# Altium project OVLYS.PrjPcb
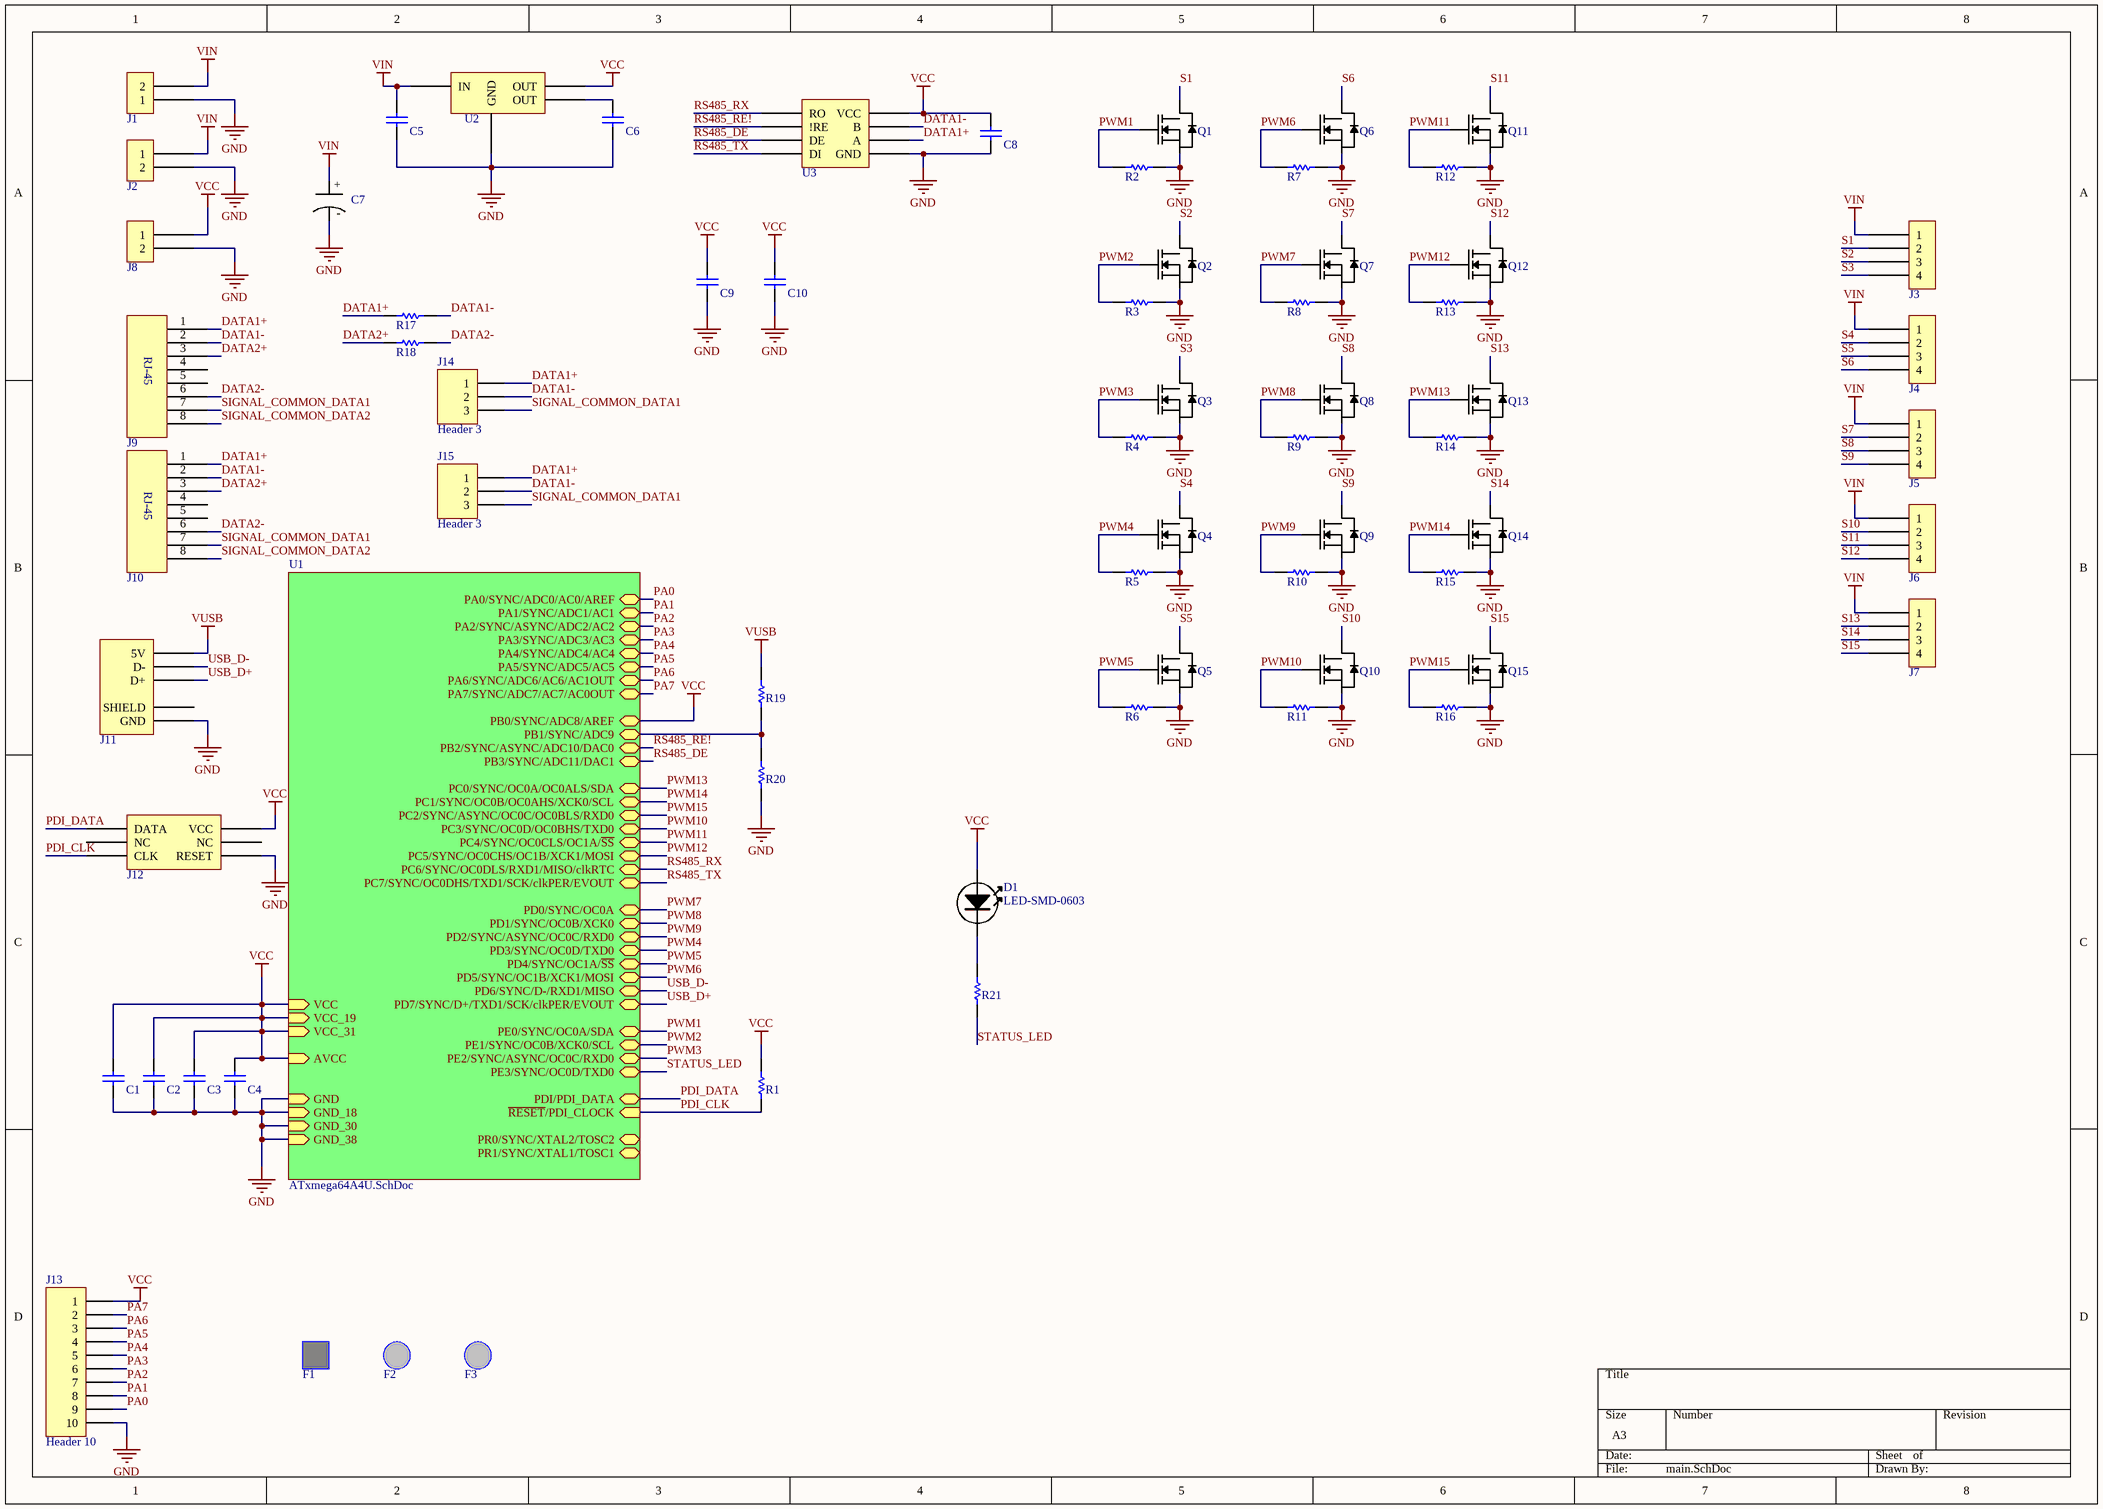
[diagram p0: main.SchDoc]
2 sheets, 69 parts. Net scope: hierarchical (ports join the sheet entries above them; power ports are global).
Board files: main.PcbDoc, panelized.PcbDoc
Sheets:
  main.SchDoc
    U1 = ATxmega64A4U.SchDoc

## Sheet main.SchDoc
size A3

### Parts
C1  CAP 3.3nF 10V 0805(2012)  [CAPC0805(2012)145_M]  (value not drawn)
C2  CAP 3.3nF 10V 0805(2012)  [CAPC0805(2012)145_M]  (value not drawn)
C3  CAP 3.3nF 10V 0805(2012)  [CAPC0805(2012)145_M]  (value not drawn)
C4  CAP 3.3nF 10V 0805(2012)  [CAPC0805(2012)145_M]  (value not drawn)
C5  CAP 1uF 16V 1210(3225)  [CAPC1210(3225)155_N]  (value not drawn)
C6  CAP 10uF 6.3V 1210(3225)  [CAPC1210(3225)170_L]  (value not drawn)
C7  ELECTROLYTIC-CAP-220uF  [ELECTROLYTIC-220uF]  (value not drawn)
C8  CAP 3.3nF 10V 0805(2012)  [CAPC0805(2012)145_M]  (value not drawn)
C9  CAP 10uF 6.3V 1210(3225)  [CAPC1210(3225)170_L]  (value not drawn)
C10  CAP 10uF 6.3V 1210(3225)  [CAPC1210(3225)170_L]  (value not drawn)
D1  LED-SMD-0603  [LED-0603]
F1  Fiducial square  [FIDU-SQUARE]  (value not drawn)
F2  Fiducial round  [FIDU-ROUND]  (value not drawn)
F3  Fiducial round  [FIDU-ROUND]  (value not drawn)
J1  PLUGGABLE-TERMINAL-2  [PLUG_TERMINAL_2]  (value not drawn)
J2  PLUGGABLE-TERMINAL-2  [PLUG_TERMINAL_2]  (value not drawn)
J3  PLUGGABLE-TERMINAL-4  [PLUG_TERMINAL_4]  (value not drawn)
J4  PLUGGABLE-TERMINAL-4  [PLUG_TERMINAL_4]  (value not drawn)
J5  PLUGGABLE-TERMINAL-4  [PLUG_TERMINAL_4]  (value not drawn)
J6  PLUGGABLE-TERMINAL-4  [PLUG_TERMINAL_4]  (value not drawn)
J7  PLUGGABLE-TERMINAL-4  [PLUG_TERMINAL_4]  (value not drawn)
J8  PLUGGABLE-TERMINAL-2  [PLUG_TERMINAL_2]  (value not drawn)
J9  RJ-45 Connector  [RJ-45]  (value not drawn)
J10  RJ-45 Connector  [RJ-45]  (value not drawn)
J11  USB-MINI  [USB-mini]  (value not drawn)
J12  PDI  [HEADER_SMD_3x2_50MIL]  (value not drawn)
J13  Header 10  [HDR1X10]
J14  Header 3  [HDR1X3]
J15  Header 3  [HDR1X3]
Q1  TSM2314CX  [SOT95P280X130-3N]  (value not drawn)
Q2  TSM2314CX  [SOT95P280X130-3N]  (value not drawn)
Q3  TSM2314CX  [SOT95P280X130-3N]  (value not drawn)
Q4  TSM2314CX  [SOT95P280X130-3N]  (value not drawn)
Q5  TSM2314CX  [SOT95P280X130-3N]  (value not drawn)
Q6  TSM2314CX  [SOT95P280X130-3N]  (value not drawn)
Q7  TSM2314CX  [SOT95P280X130-3N]  (value not drawn)
Q8  TSM2314CX  [SOT95P280X130-3N]  (value not drawn)
Q9  TSM2314CX  [SOT95P280X130-3N]  (value not drawn)
Q10  TSM2314CX  [SOT95P280X130-3N]  (value not drawn)
Q11  TSM2314CX  [SOT95P280X130-3N]  (value not drawn)
Q12  TSM2314CX  [SOT95P280X130-3N]  (value not drawn)
Q13  TSM2314CX  [SOT95P280X130-3N]  (value not drawn)
Q14  TSM2314CX  [SOT95P280X130-3N]  (value not drawn)
Q15  TSM2314CX  [SOT95P280X130-3N]  (value not drawn)
R1  10K 1% 0805(2012)  [RESC0805(2012)_M]  (value not drawn)
R2  10K 1% 0805(2012)  [RESC0805(2012)_M]  (value not drawn)
R3  10K 1% 0805(2012)  [RESC0805(2012)_M]  (value not drawn)
R4  10K 1% 0805(2012)  [RESC0805(2012)_M]  (value not drawn)
R5  10K 1% 0805(2012)  [RESC0805(2012)_M]  (value not drawn)
R6  10K 1% 0805(2012)  [RESC0805(2012)_M]  (value not drawn)
R7  10K 1% 0805(2012)  [RESC0805(2012)_M]  (value not drawn)
R8  10K 1% 0805(2012)  [RESC0805(2012)_M]  (value not drawn)
R9  10K 1% 0805(2012)  [RESC0805(2012)_M]  (value not drawn)
R10  10K 1% 0805(2012)  [RESC0805(2012)_M]  (value not drawn)
R11  10K 1% 0805(2012)  [RESC0805(2012)_M]  (value not drawn)
R12  10K 1% 0805(2012)  [RESC0805(2012)_M]  (value not drawn)
R13  10K 1% 0805(2012)  [RESC0805(2012)_M]  (value not drawn)
R14  10K 1% 0805(2012)  [RESC0805(2012)_M]  (value not drawn)
R15  10K 1% 0805(2012)  [RESC0805(2012)_M]  (value not drawn)
R16  10K 1% 0805(2012)  [RESC0805(2012)_M]  (value not drawn)
R17  120R 1% 0805(2012)  [RESC0805(2012)_M]  (value not drawn)
R18  120R 1% 0805(2012)  [RESC0805(2012)_M]  (value not drawn)
R19  10K 1% 0805(2012)  [RESC0805(2012)_M]  (value not drawn)
R20  15K 1% 0805(2012)  [RESC0805(2012)_L]  (value not drawn)
R21  200R 1% 0805(2012)  [RESC0805(2012)_L]  (value not drawn)
U2  TLV1117  [SOT230P700X180-4N]  (value not drawn)
U3  MAX3485  [SOP127P600X175-8N]  (value not drawn)

### Sub-sheets
U1 = ATxmega64A4U.SchDoc: PR0/SYNC/XTAL2/TOSC2 (bidir), PR1/SYNC/XTAL1/TOSC1 (bidir), ~{RESET}/PDI_CLOCK (in), VCC, VCC_19, AVCC, GND, GND_18, GND_30, PA0/SYNC/ADC0/AC0/AREF (bidir), PA1/SYNC/ADC1/AC1 (bidir), PA2/SYNC/ASYNC/ADC2/AC2 (bidir), PA3/SYNC/ADC3/AC3 (bidir), PA4/SYNC/ADC4/AC4 (bidir), PA5/SYNC/ADC5/AC5 (bidir), PA6/SYNC/ADC6/AC6/AC1OUT (bidir), PA7/SYNC/ADC7/AC7/AC0OUT (bidir), PB0/SYNC/ADC8/AREF (bidir), PB1/SYNC/ADC9 (bidir), PB3/SYNC/ADC11/DAC1 (bidir), PC0/SYNC/OC0A/OC0ALS/SDA (bidir), PC1/SYNC/OC0B/OC0AHS/XCK0/SCL (bidir), PC2/SYNC/ASYNC/OC0C/OC0BLS/RXD0 (bidir), PC3/SYNC/OC0D/OC0BHS/TXD0 (bidir), PC4/SYNC/OC0CLS/OC1A/~{SS} (bidir), PC5/SYNC/OC0CHS/OC1B/XCK1/MOSI (bidir), PC6/SYNC/OC0DLS/RXD1/MISO/clkRTC (bidir), PC7/SYNC/OC0DHS/TXD1/SCK/clkPER/EVOUT (bidir), PD0/SYNC/OC0A (bidir), PD2/SYNC/ASYNC/OC0C/RXD0 (bidir), PD3/SYNC/OC0D/TXD0 (bidir), PD4/SYNC/OC1A/~{SS} (bidir), PD5/SYNC/OC1B/XCK1/MOSI (bidir), PD6/SYNC/D-/RXD1/MISO (bidir), PD7/SYNC/D+/TXD1/SCK/clkPER/EVOUT (bidir), PDI/PDI_DATA (bidir), PE0/SYNC/OC0A/SDA (bidir), PE1/SYNC/OC0B/XCK0/SCL (bidir), PE2/SYNC/ASYNC/OC0C/RXD0 (bidir), GND_38, PB2/SYNC/ASYNC/ADC10/DAC0 (bidir), PD1/SYNC/OC0B/XCK0 (bidir), PE3/SYNC/OC0D/TXD0 (bidir), VCC_31

### Nets
GND: C1.1 C2.1 C3.1 C4.1 C5.1 C6.1 C7.2(-) C8.1 C9.1 C10.1 J1.1 J2.2 J8.2 J11.5(GND) J12.6(RESET) J13.10 Q1.2(S) Q2.2(S) Q3.2(S) Q4.2(S) Q5.2(S) Q6.2(S) Q7.2(S) Q8.2(S) Q9.2(S) Q10.2(S) Q11.2(S) Q12.2(S) Q13.2(S) Q14.2(S) Q15.2(S) R2.2 R3.2 R4.2 R5.2 R6.2 R7.2 R8.2 R9.2 R10.2 R11.2 R12.2 R13.2 R14.2 R15.2 R16.2 R20.1 U2.1(GND) U3.5(GND) ; sheet U1/GND, sheet U1/GND_18, sheet U1/GND_30, sheet U1/GND_38
VCC: C1.2 C2.2 C3.2 C4.2 C8.2 C9.2 C10.2 D1.1 J8.1 J12.2(VCC) J13.1 R1.2 U2.4(OUT) U3.8(VCC) ; sheet U1/VCC, sheet U1/VCC_19, sheet U1/AVCC, sheet U1/PB0/SYNC/ADC8/AREF, sheet U1/VCC_31
VIN: C5.2 C7.1(+) J1.2 J2.1 J3.1 J4.1 J5.1 J6.1 J7.1 U2.3(IN)
VUSB: J11.1(5V) R19.2
DATA1+: J9.1 J10.1 J14.1 J15.1 R17.1 U3.6(A)
DATA1-: J9.2 J10.2 J14.2 J15.2 R17.2 U3.7(B)
DATA2+: J9.3 J10.3 R18.1
DATA2-: J9.6 J10.6 R18.2
PA0: J13.9 ; sheet U1/PA0/SYNC/ADC0/AC0/AREF
PA1: J13.8 ; sheet U1/PA1/SYNC/ADC1/AC1
PA2: J13.7 ; sheet U1/PA2/SYNC/ASYNC/ADC2/AC2
PA3: J13.6 ; sheet U1/PA3/SYNC/ADC3/AC3
PA4: J13.5 ; sheet U1/PA4/SYNC/ADC4/AC4
PA5: J13.4 ; sheet U1/PA5/SYNC/ADC5/AC5
PA6: J13.3 ; sheet U1/PA6/SYNC/ADC6/AC6/AC1OUT
PA7: J13.2 ; sheet U1/PA7/SYNC/ADC7/AC7/AC0OUT
PDI_CLK: J12.5(CLK) R1.1 ; sheet U1/~{RESET}/PDI_CLOCK
PDI_DATA: J12.1(DATA) ; sheet U1/PDI/PDI_DATA
PWM1: Q1.1(G) R2.1 ; sheet U1/PE0/SYNC/OC0A/SDA
PWM2: Q2.1(G) R3.1 ; sheet U1/PE1/SYNC/OC0B/XCK0/SCL
PWM3: Q3.1(G) R4.1 ; sheet U1/PE2/SYNC/ASYNC/OC0C/RXD0
PWM4: Q4.1(G) R5.1 ; sheet U1/PD3/SYNC/OC0D/TXD0
PWM5: Q5.1(G) R6.1 ; sheet U1/PD4/SYNC/OC1A/~{SS}
PWM6: Q6.1(G) R7.1 ; sheet U1/PD5/SYNC/OC1B/XCK1/MOSI
PWM7: Q7.1(G) R8.1 ; sheet U1/PD0/SYNC/OC0A
PWM8: Q8.1(G) R9.1 ; sheet U1/PD1/SYNC/OC0B/XCK0
PWM9: Q9.1(G) R10.1 ; sheet U1/PD2/SYNC/ASYNC/OC0C/RXD0
PWM10: Q10.1(G) R11.1 ; sheet U1/PC3/SYNC/OC0D/OC0BHS/TXD0
PWM11: Q11.1(G) R12.1 ; sheet U1/PC4/SYNC/OC0CLS/OC1A/~{SS}
PWM12: Q12.1(G) R13.1 ; sheet U1/PC5/SYNC/OC0CHS/OC1B/XCK1/MOSI
PWM13: Q13.1(G) R14.1 ; sheet U1/PC0/SYNC/OC0A/OC0ALS/SDA
PWM14: Q14.1(G) R15.1 ; sheet U1/PC1/SYNC/OC0B/OC0AHS/XCK0/SCL
PWM15: Q15.1(G) R16.1 ; sheet U1/PC2/SYNC/ASYNC/OC0C/OC0BLS/RXD0
RS485_DE: U3.3(DE) ; sheet U1/PB3/SYNC/ADC11/DAC1
RS485_RE!: U3.2(!RE) ; sheet U1/PB2/SYNC/ASYNC/ADC10/DAC0
RS485_RX: U3.1(RO) ; sheet U1/PC6/SYNC/OC0DLS/RXD1/MISO/clkRTC
RS485_TX: U3.4(DI) ; sheet U1/PC7/SYNC/OC0DHS/TXD1/SCK/clkPER/EVOUT
S1: J3.2 Q1.3(D)
S2: J3.3 Q2.3(D)
S3: J3.4 Q3.3(D)
S4: J4.2 Q4.3(D)
S5: J4.3 Q5.3(D)
S6: J4.4 Q6.3(D)
S7: J5.2 Q7.3(D)
S8: J5.3 Q8.3(D)
S9: J5.4 Q9.3(D)
S10: J6.2 Q10.3(D)
S11: J6.3 Q11.3(D)
S12: J6.4 Q12.3(D)
S13: J7.2 Q13.3(D)
S14: J7.3 Q14.3(D)
S15: J7.4 Q15.3(D)
SIGNAL_COMMON_DATA1: J9.7 J10.7 J14.3 J15.3
SIGNAL_COMMON_DATA2: J9.8 J10.8
STATUS_LED: R21.1 ; sheet U1/PE3/SYNC/OC0D/TXD0
USB_D+: J11.3(D+) ; sheet U1/PD7/SYNC/D+/TXD1/SCK/clkPER/EVOUT
USB_D-: J11.2(D-) ; sheet U1/PD6/SYNC/D-/RXD1/MISO
NetC6_2: C6.2 U2.2(OUT)
NetD1_2: D1.2 R21.2
NetR19_1: R19.1 R20.2 ; sheet U1/PB1/SYNC/ADC9

Not connected (* = marked no-connect by the designer): J9 4 5; J10 4 5; J11 0(SHIELD); J12 3(NC) 4(NC)

### Library data of the parts
C1-C4 C8 = CMP-1036-03387-1: CAP 3.3nF 10V ±1% 0805 (2012 Metric) Thickness 1.45mm SMD; Case-Metric: 2012; Case-EIA: 0805; Rated Voltage: 10 V; Value: 3.3nF; Technology: SMT; Tolerance: ±1%; Max Thickness: 1.45 mm
C5 = CMP-1038-02008-1: CAP 1uF 16V ±5% 1210 (3225 Metric) Thickness 1.45mm SMD; Case-Metric: 3225; Case-EIA: 1210; Max Thickness: 1.45 mm; Technology: SMT; Rated Voltage: 16 V; Value: 1uF; Tolerance: ±5%
C6 C9 C10 = CMP-1038-02188-1: CAP 10uF 6.3V ±10% 1210 (3225 Metric) Thickness 1.7mm SMD; Case-EIA: 1210; Case-Metric: 3225; Technology: SMT; Tolerance: ±10%; Rated Voltage: 6.3 V; Value: 10uF; Max Thickness: 1.7 mm
D1 = CMP-00004-A.1: SMD Led 0603
F1 = FIDUCIAL_SQUARE
F2 F3 = FIDUCIAL_ROUND
J9 J10 = CMP-00009-A.1: RJ-45 Ethernet Connector; Tolerance: 1; Temp. Coefficent: ±100; Technology: SMT
J11 = CMP-00000-A.2: USB-Mini Connector; Tolerance: 1; Temp. Coefficent: ±100; Technology: SMT
J13 = Header 10: Header, 10-Pin; LatestRevisionDate: 17-Jul-2002; LatestRevisionNote: Re-released for DXP Platform.; Publisher: Altium Limited
J14 J15 = Header 3: Header, 3-Pin; LatestRevisionDate: 17-Jul-2002; LatestRevisionNote: Re-released for DXP Platform.; Publisher: Altium Limited
Q1-Q15 = TSM2314CX: MOSFET 4.9A max switching load
R1-R16 R19 = CMP-1013-00623-1: 10K 0.125W 1% 0805 (2012 Metric)  SMD; Value: 10000.00 Ohm; Case-Metric: 2012; Case-EIA: 0805; Tolerance: 1 %; Power: 0.125 W; Technology: SMT
R17 R18 = CMP-1013-00405-1: 120R 0.125W 1% 0805 (2012 Metric)  SMD; Case-Metric: 2012; Case-EIA: 0805; Value: 120.00 Ohm; Tolerance: 1 %; Technology: SMT; Power: 0.125 W
R20 = CMP-1013-00641-1: 15K 0.125W 1% 0805 (2012 Metric)  SMD; Case-Metric: 2012; Case-EIA: 0805; Value: 15000.00 Ohm; Power: 0.125 W; Tolerance: 1 %; Technology: SMT
R21 = CMP-1013-00429-1: 200R 0.125W 1% 0805 (2012 Metric)  SMD; Case-EIA: 0805; Case-Metric: 2012; Value: 200.00 Ohm; Technology: SMT; Power: 0.125 W; Tolerance: 1 %
U2 = CMP-00003-A.1: 3.3V Linear Regulator

## Sheet ATxmega64A4U.SchDoc
size A3
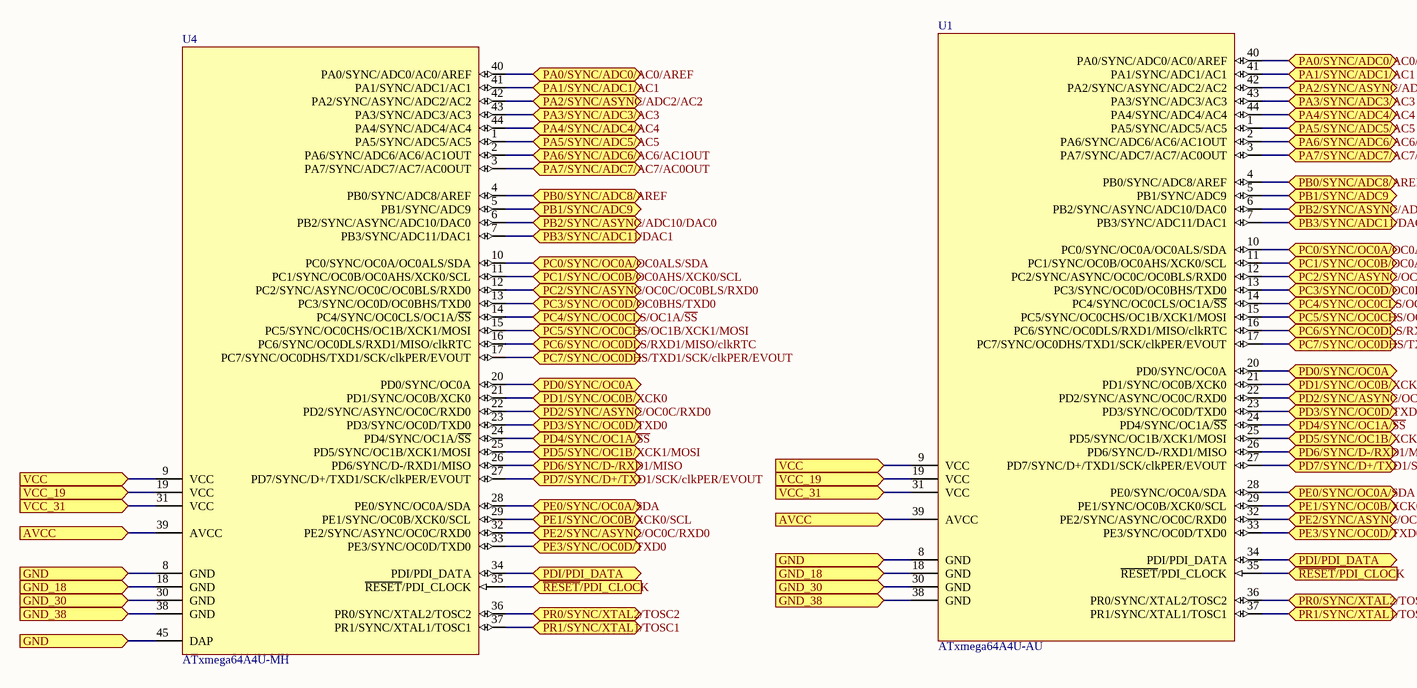
[diagram p1: ATxmega64A4U.SchDoc]

### Parts
U1  ATxmega64A4U-AU  [44A_N]
U4  ATxmega64A4U-MH  [44M1_N]

### Ports
AVCC, GND, GND_18, GND_30, GND_38, PA0/SYNC/ADC0/AC0/AREF (bidir), PA1/SYNC/ADC1/AC1 (bidir), PA2/SYNC/ASYNC/ADC2/AC2 (bidir), PA3/SYNC/ADC3/AC3 (bidir), PA4/SYNC/ADC4/AC4 (bidir), PA5/SYNC/ADC5/AC5 (bidir), PA6/SYNC/ADC6/AC6/AC1OUT (bidir), PA7/SYNC/ADC7/AC7/AC0OUT (bidir), PB0/SYNC/ADC8/AREF (bidir), PB1/SYNC/ADC9 (bidir), PB2/SYNC/ASYNC/ADC10/DAC0 (bidir), PB3/SYNC/ADC11/DAC1 (bidir), PC0/SYNC/OC0A/OC0ALS/SDA (bidir), PC1/SYNC/OC0B/OC0AHS/XCK0/SCL (bidir), PC2/SYNC/ASYNC/OC0C/OC0BLS/RXD0 (bidir), PC3/SYNC/OC0D/OC0BHS/TXD0 (bidir), PC4/SYNC/OC0CLS/OC1A/~{SS} (bidir), PC5/SYNC/OC0CHS/OC1B/XCK1/MOSI (bidir), PC6/SYNC/OC0DLS/RXD1/MISO/clkRTC (bidir), PC7/SYNC/OC0DHS/TXD1/SCK/clkPER/EVOUT (bidir), PD0/SYNC/OC0A (bidir), PD1/SYNC/OC0B/XCK0 (bidir), PD2/SYNC/ASYNC/OC0C/RXD0 (bidir), PD3/SYNC/OC0D/TXD0 (bidir), PD4/SYNC/OC1A/~{SS} (bidir), PD5/SYNC/OC1B/XCK1/MOSI (bidir), PD6/SYNC/D-/RXD1/MISO (bidir), PD7/SYNC/D+/TXD1/SCK/clkPER/EVOUT (bidir), PDI/PDI_DATA (bidir), PE0/SYNC/OC0A/SDA (bidir), PE1/SYNC/OC0B/XCK0/SCL (bidir), PE2/SYNC/ASYNC/OC0C/RXD0 (bidir), PE3/SYNC/OC0D/TXD0 (bidir), PR0/SYNC/XTAL2/TOSC2 (bidir), PR1/SYNC/XTAL1/TOSC1 (bidir), VCC, VCC_19, VCC_31, ~{RESET}/PDI_CLOCK (in)

### Nets
GND: U1.8(GND) U1.18(GND) U1.30(GND) U1.38(GND) U4.8(GND) U4.18(GND) U4.30(GND) U4.38(GND) U4.45(DAP) ; port GND, port GND_18, port GND_30, port GND_38
VCC: U1.4(PB0/SYNC/ADC8/AREF) U1.9(VCC) U1.19(VCC) U1.31(VCC) U1.39(AVCC) U4.4(PB0/SYNC/ADC8/AREF) U4.9(VCC) U4.19(VCC) U4.31(VCC) U4.39(AVCC) ; port VCC, port VCC_19, port AVCC, port PB0/SYNC/ADC8/AREF, port VCC_31
PA0: U1.40(PA0/SYNC/ADC0/AC0/AREF) U4.40(PA0/SYNC/ADC0/AC0/AREF) ; port PA0/SYNC/ADC0/AC0/AREF
PA1: U1.41(PA1/SYNC/ADC1/AC1) U4.41(PA1/SYNC/ADC1/AC1) ; port PA1/SYNC/ADC1/AC1
PA2: U1.42(PA2/SYNC/ASYNC/ADC2/AC2) U4.42(PA2/SYNC/ASYNC/ADC2/AC2) ; port PA2/SYNC/ASYNC/ADC2/AC2
PA3: U1.43(PA3/SYNC/ADC3/AC3) U4.43(PA3/SYNC/ADC3/AC3) ; port PA3/SYNC/ADC3/AC3
PA4: U1.44(PA4/SYNC/ADC4/AC4) U4.44(PA4/SYNC/ADC4/AC4) ; port PA4/SYNC/ADC4/AC4
PA5: U1.1(PA5/SYNC/ADC5/AC5) U4.1(PA5/SYNC/ADC5/AC5) ; port PA5/SYNC/ADC5/AC5
PA6: U1.2(PA6/SYNC/ADC6/AC6/AC1OUT) U4.2(PA6/SYNC/ADC6/AC6/AC1OUT) ; port PA6/SYNC/ADC6/AC6/AC1OUT
PA7: U1.3(PA7/SYNC/ADC7/AC7/AC0OUT) U4.3(PA7/SYNC/ADC7/AC7/AC0OUT) ; port PA7/SYNC/ADC7/AC7/AC0OUT
PDI_CLK: U1.35(~{RESET}/PDI_CLOCK) U4.35(~{RESET}/PDI_CLOCK) ; port ~{RESET}/PDI_CLOCK
PDI_DATA: U1.34(PDI/PDI_DATA) U4.34(PDI/PDI_DATA) ; port PDI/PDI_DATA
PWM1: U1.28(PE0/SYNC/OC0A/SDA) U4.28(PE0/SYNC/OC0A/SDA) ; port PE0/SYNC/OC0A/SDA
PWM2: U1.29(PE1/SYNC/OC0B/XCK0/SCL) U4.29(PE1/SYNC/OC0B/XCK0/SCL) ; port PE1/SYNC/OC0B/XCK0/SCL
PWM3: U1.32(PE2/SYNC/ASYNC/OC0C/RXD0) U4.32(PE2/SYNC/ASYNC/OC0C/RXD0) ; port PE2/SYNC/ASYNC/OC0C/RXD0
PWM4: U1.23(PD3/SYNC/OC0D/TXD0) U4.23(PD3/SYNC/OC0D/TXD0) ; port PD3/SYNC/OC0D/TXD0
PWM5: U1.24(PD4/SYNC/OC1A/~{SS}) U4.24(PD4/SYNC/OC1A/~{SS}) ; port PD4/SYNC/OC1A/~{SS}
PWM6: U1.25(PD5/SYNC/OC1B/XCK1/MOSI) U4.25(PD5/SYNC/OC1B/XCK1/MOSI) ; port PD5/SYNC/OC1B/XCK1/MOSI
PWM7: U1.20(PD0/SYNC/OC0A) U4.20(PD0/SYNC/OC0A) ; port PD0/SYNC/OC0A
PWM8: U1.21(PD1/SYNC/OC0B/XCK0) U4.21(PD1/SYNC/OC0B/XCK0) ; port PD1/SYNC/OC0B/XCK0
PWM9: U1.22(PD2/SYNC/ASYNC/OC0C/RXD0) U4.22(PD2/SYNC/ASYNC/OC0C/RXD0) ; port PD2/SYNC/ASYNC/OC0C/RXD0
PWM10: U1.13(PC3/SYNC/OC0D/OC0BHS/TXD0) U4.13(PC3/SYNC/OC0D/OC0BHS/TXD0) ; port PC3/SYNC/OC0D/OC0BHS/TXD0
PWM11: U1.14(PC4/SYNC/OC0CLS/OC1A/~{SS}) U4.14(PC4/SYNC/OC0CLS/OC1A/~{SS}) ; port PC4/SYNC/OC0CLS/OC1A/~{SS}
PWM12: U1.15(PC5/SYNC/OC0CHS/OC1B/XCK1/MOSI) U4.15(PC5/SYNC/OC0CHS/OC1B/XCK1/MOSI) ; port PC5/SYNC/OC0CHS/OC1B/XCK1/MOSI
PWM13: U1.10(PC0/SYNC/OC0A/OC0ALS/SDA) U4.10(PC0/SYNC/OC0A/OC0ALS/SDA) ; port PC0/SYNC/OC0A/OC0ALS/SDA
PWM14: U1.11(PC1/SYNC/OC0B/OC0AHS/XCK0/SCL) U4.11(PC1/SYNC/OC0B/OC0AHS/XCK0/SCL) ; port PC1/SYNC/OC0B/OC0AHS/XCK0/SCL
PWM15: U1.12(PC2/SYNC/ASYNC/OC0C/OC0BLS/RXD0) U4.12(PC2/SYNC/ASYNC/OC0C/OC0BLS/RXD0) ; port PC2/SYNC/ASYNC/OC0C/OC0BLS/RXD0
RS485_DE: U1.7(PB3/SYNC/ADC11/DAC1) U4.7(PB3/SYNC/ADC11/DAC1) ; port PB3/SYNC/ADC11/DAC1
RS485_RE!: U1.6(PB2/SYNC/ASYNC/ADC10/DAC0) U4.6(PB2/SYNC/ASYNC/ADC10/DAC0) ; port PB2/SYNC/ASYNC/ADC10/DAC0
RS485_RX: U1.16(PC6/SYNC/OC0DLS/RXD1/MISO/clkRTC) U4.16(PC6/SYNC/OC0DLS/RXD1/MISO/clkRTC) ; port PC6/SYNC/OC0DLS/RXD1/MISO/clkRTC
RS485_TX: U1.17(PC7/SYNC/OC0DHS/TXD1/SCK/clkPER/EVOUT) U4.17(PC7/SYNC/OC0DHS/TXD1/SCK/clkPER/EVOUT) ; port PC7/SYNC/OC0DHS/TXD1/SCK/clkPER/EVOUT
STATUS_LED: U1.33(PE3/SYNC/OC0D/TXD0) U4.33(PE3/SYNC/OC0D/TXD0) ; port PE3/SYNC/OC0D/TXD0
USB_D+: U1.27(PD7/SYNC/D+/TXD1/SCK/clkPER/EVOUT) U4.27(PD7/SYNC/D+/TXD1/SCK/clkPER/EVOUT) ; port PD7/SYNC/D+/TXD1/SCK/clkPER/EVOUT
USB_D-: U1.26(PD6/SYNC/D-/RXD1/MISO) U4.26(PD6/SYNC/D-/RXD1/MISO) ; port PD6/SYNC/D-/RXD1/MISO
NetR19_1: U1.5(PB1/SYNC/ADC9) U4.5(PB1/SYNC/ADC9) ; port PB1/SYNC/ADC9
NetU1_36: U1.36(PR0/SYNC/XTAL2/TOSC2) U4.36(PR0/SYNC/XTAL2/TOSC2) ; port PR0/SYNC/XTAL2/TOSC2
NetU1_37: U1.37(PR1/SYNC/XTAL1/TOSC1) U4.37(PR1/SYNC/XTAL1/TOSC1) ; port PR1/SYNC/XTAL1/TOSC1

### Library data of the parts
U1 = CMP-0094-00068-1: 8/16-bit AVR XMEGA A4U Microcontroller, 1.6-3.6V, 32MHz, 64K + 4KB Flash, 2K EEPROM, 4K SRAM, 44-pin TQFP, Industrial Grade (-40°C to 85°C); PackageReference: 44A; PackageVersion: revC, Oct-2010; Code_JEDEC: MS-026-ACB; PackageDescription: 44-Pin Plastic Thin Profile Quad Flat Pack, 10 x 10 x 1.0 mm Body, 0.8 mm Pitch (TQFP); DatasheetVersion: revB, Dec-2011; ComponentLink2URL: http://www.atmel.com/dyn/resources/prod_documents/doc8387.pdf; ComponentLink1Description: Manufacturer URL; ComponentLink1URL: http://www.atmel.com/; ComponentLink2Description: ATxmega16A4U/32A4U/64A4U/128A4U Datasheet
U4 = CMP-0094-00055-1: 8/16-bit AVR XMEGA A4U Microcontroller, 1.6-3.6V, 32MHz, 64K + 4KB Flash, 2K EEPROM, 4K SRAM, 44-pin VQFN, Industrial Grade (-40°C to 85°C); PackageReference: 44M1; ComponentLink1Description: Manufacturer URL; Code_JEDEC: MO-220-VKKD-1; PackageDescription: 44-Pin Plastic Very Thin Quad Flat No-Lead Package, 7 x 7 x 1.0 mm Body, 0.5 mm Pitch (VQFN), 5.2 mm Exposed Pad; DatasheetVersion: revB, Dec-2011; ComponentLink2URL: http://www.atmel.com/dyn/resources/prod_documents/doc8387.pdf; PackageVersion: revH, Sep-2008; ComponentLink1URL: http://www.atmel.com/; ComponentLink2Description: ATxmega16A4U/32A4U/64A4U/128A4U Datasheet

## Nets that join several sheets
GND: main (49 pins), ATxmega64A4U (9 pins)
VCC: main (14 pins), ATxmega64A4U (10 pins)
NetR19_1: main (R19.1 R20.2), ATxmega64A4U (U1.5 U4.5)
PA0: main (J13.9), ATxmega64A4U (U1.40 U4.40)
PA1: main (J13.8), ATxmega64A4U (U1.41 U4.41)
PA2: main (J13.7), ATxmega64A4U (U1.42 U4.42)
PA3: main (J13.6), ATxmega64A4U (U1.43 U4.43)
PA4: main (J13.5), ATxmega64A4U (U1.44 U4.44)
PA5: main (J13.4), ATxmega64A4U (U1.1 U4.1)
PA6: main (J13.3), ATxmega64A4U (U1.2 U4.2)
PA7: main (J13.2), ATxmega64A4U (U1.3 U4.3)
PDI_CLK: main (J12.5 R1.1), ATxmega64A4U (U1.35 U4.35)
PDI_DATA: main (J12.1), ATxmega64A4U (U1.34 U4.34)
PWM1: main (Q1.1 R2.1), ATxmega64A4U (U1.28 U4.28)
PWM2: main (Q2.1 R3.1), ATxmega64A4U (U1.29 U4.29)
PWM3: main (Q3.1 R4.1), ATxmega64A4U (U1.32 U4.32)
PWM4: main (Q4.1 R5.1), ATxmega64A4U (U1.23 U4.23)
PWM5: main (Q5.1 R6.1), ATxmega64A4U (U1.24 U4.24)
PWM6: main (Q6.1 R7.1), ATxmega64A4U (U1.25 U4.25)
PWM7: main (Q7.1 R8.1), ATxmega64A4U (U1.20 U4.20)
PWM8: main (Q8.1 R9.1), ATxmega64A4U (U1.21 U4.21)
PWM9: main (Q9.1 R10.1), ATxmega64A4U (U1.22 U4.22)
PWM10: main (Q10.1 R11.1), ATxmega64A4U (U1.13 U4.13)
PWM11: main (Q11.1 R12.1), ATxmega64A4U (U1.14 U4.14)
PWM12: main (Q12.1 R13.1), ATxmega64A4U (U1.15 U4.15)
PWM13: main (Q13.1 R14.1), ATxmega64A4U (U1.10 U4.10)
PWM14: main (Q14.1 R15.1), ATxmega64A4U (U1.11 U4.11)
PWM15: main (Q15.1 R16.1), ATxmega64A4U (U1.12 U4.12)
RS485_DE: main (U3.3), ATxmega64A4U (U1.7 U4.7)
RS485_RE!: main (U3.2), ATxmega64A4U (U1.6 U4.6)
RS485_RX: main (U3.1), ATxmega64A4U (U1.16 U4.16)
RS485_TX: main (U3.4), ATxmega64A4U (U1.17 U4.17)
STATUS_LED: main (R21.1), ATxmega64A4U (U1.33 U4.33)
USB_D+: main (J11.3), ATxmega64A4U (U1.27 U4.27)
USB_D-: main (J11.2), ATxmega64A4U (U1.26 U4.26)

## Assembly variants
TQFP: not fitted U4
QFN: not fitted U1